# Altium schematic sheet iox.SchDoc
size A; SheetNumber: 2; SheetTotal: 3
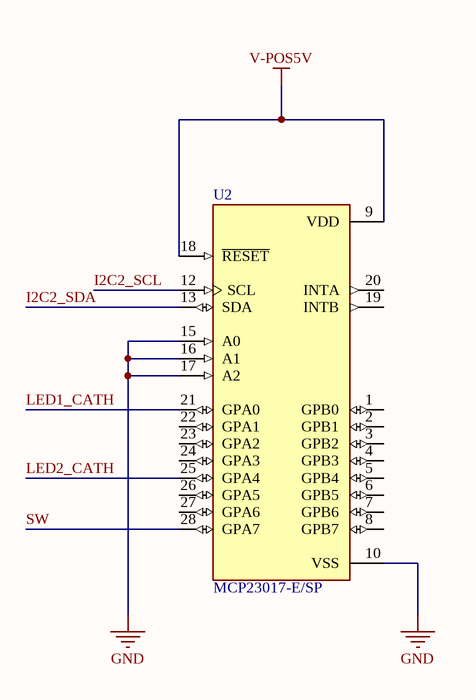
[diagram p0: iox.SchDoc]

## Parts
U2  MCP23017-E/SP  [DIP787W45P254L3556H508Q28]

## Nets
GND: U2.10(VSS) U2.15(A0) U2.16(A1) U2.17(A2)
V-POS5V: U2.9(VDD) U2.18(~{RESET})
I2C2_SCL: U2.12(SCL)
I2C2_SDA: U2.13(SDA)
LED1_CATH: U2.21(GPA0)
LED2_CATH: U2.25(GPA4)
SW: U2.28(GPA7)

Not connected (* = marked no-connect by the designer): U2 1(GPB0) 2(GPB1) 3(GPB2) 4(GPB3) 5(GPB4) 6(GPB5) 7(GPB6) 8(GPB7) 19(INTB) 20(INTA) 22(GPA1) 23(GPA2) 24(GPA3) 26(GPA5) 27(GPA6)

## Library data of the parts
U2 = MCP23017-E/SP: I/O Expander 16 IÂ²C 1.7MHz 28-SPDIP; MF: Microchip; Availability: Unavailable; MP: MCP23017-E/SP; Price: None; Value: *; SnapEDA_Link: https://www.snapeda.com/parts/MCP23017-E/SP/Microchip/view-part/48605/?ref=snap; Package: DIP-28 Microchip